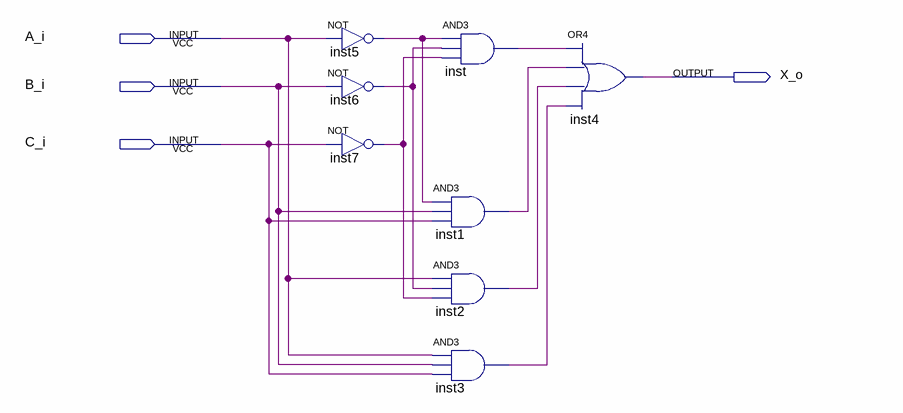
[diagram p0: schematic sheet]
// Quartus schematic led.bdf as structural Verilog: 8 symbols, 4 pins
module led (
  input  A_i,
  input  B_i,
  input  C_i,
  output X_o
);

  wire inst1_out, inst2_out, inst3_out, inst5_out, inst6_out, inst7_out, inst_out;

  not inst5 (inst5_out, A_i);
  not inst6 (inst6_out, B_i);
  not inst7 (inst7_out, C_i);
  and inst1 (inst1_out, inst5_out, B_i, C_i);
  and inst2 (inst2_out, A_i, inst6_out, inst7_out);
  and inst3 (inst3_out, A_i, B_i, C_i);
  and inst (inst_out, inst5_out, inst6_out, inst7_out);
  or inst4 (X_o, inst_out, inst1_out, inst2_out, inst3_out);
endmodule
